# EAGLE schematic BBB_P9_Headers_0A (EAGLE 7.3.0)
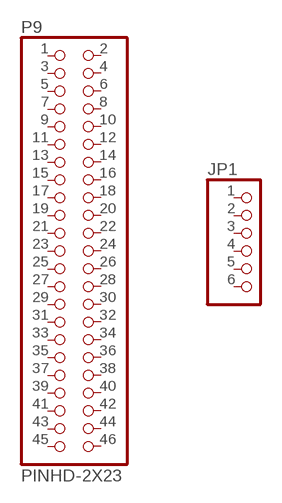
[diagram p0: schematic, sheet 1]

## Parts
JP1  PINHD-1X6  [1X06]
P9  PINHD-2X23  [2X23]
Unconnected: JP1.1 JP1.2 JP1.3 JP1.4 JP1.5 JP1.6 P9.1 P9.2 P9.3 P9.4 P9.5 P9.6 P9.7 P9.8 P9.9 P9.10 P9.11 P9.12 P9.13 P9.14 P9.15 P9.16 P9.17 P9.18 P9.19 P9.20 P9.21 P9.22 P9.23 P9.24 P9.25 P9.26 P9.27 P9.28 P9.29 P9.30 P9.31 P9.32 P9.33 P9.34 P9.35 P9.36 P9.37 P9.38 P9.39 P9.40 P9.41 P9.42 P9.43 P9.44 P9.45 P9.46

## Library data of the parts
JP1 = pinhead:PINHD-1X6: PIN HEADER
P9 = Magister-Libraries:PINHD-2X23